# EAGLE design 5v_AC_DC (EAGLE 9.6.2)
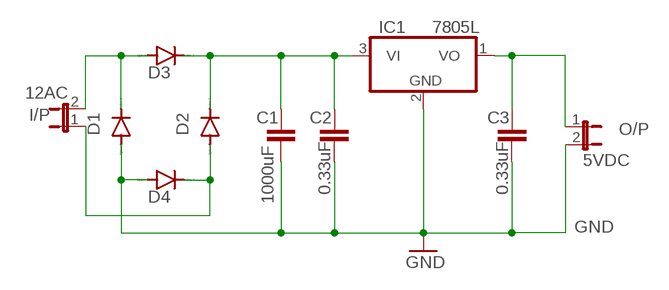
[diagram p0: schematic, sheet 1]

## Parts
C1  1000uF  C2,5-3  [C2.5-3]
C2  0.33uF  C2,5-3  [C2.5-3]
C3  0.33uF  C2,5-3  [C2.5-3]
D1  1N4004  [DO41-10]
D2  1N4004  [DO41-10]
D3  1N4004  [DO41-10]
D4  1N4004  [DO41-10]
I/P  12AC  JP1E  [JP1]
IC1  7805L  [TO92]
O/P  5VDC  JP1E  [JP1]

## Nets
GND: C1.2 C2.2 C3.2 D1.A D4.A IC1.2(GND) O/P.2
N$1: C3.1 IC1.1(VO) O/P.1
N$3: C1.1 C2.1 D2.C D3.C IC1.3(VI)
N$4: D2.A D4.C I/P.1
N$6: D1.C D3.A I/P.2

## Library data of the parts
C1-C3 = capacitor-wima:C: CAPACITOR naming: grid - package width
D1-D4 = diode:1N4004: DIODE general purpose rectifier, 1 A
I/P O/P = jumper:JP1E: JUMPER
IC1 = linear:78*: Positive VOLTAGE REGULATOR Source: http://cache.national.com/ds/LM/LM78L05.pdf http://www.fairchildsemi.com/ds/LM/LM7805.pdf

## Board
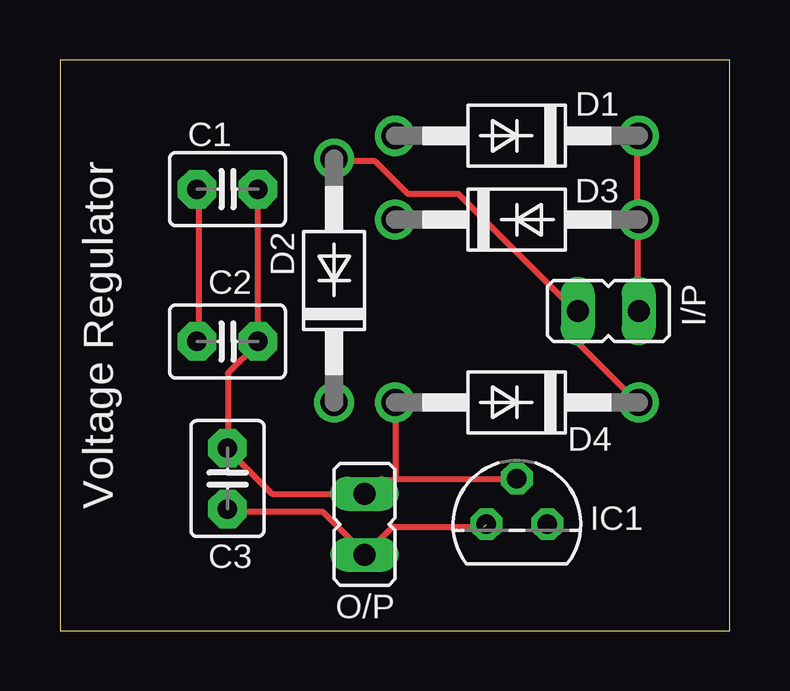
[diagram p1: board, top side]
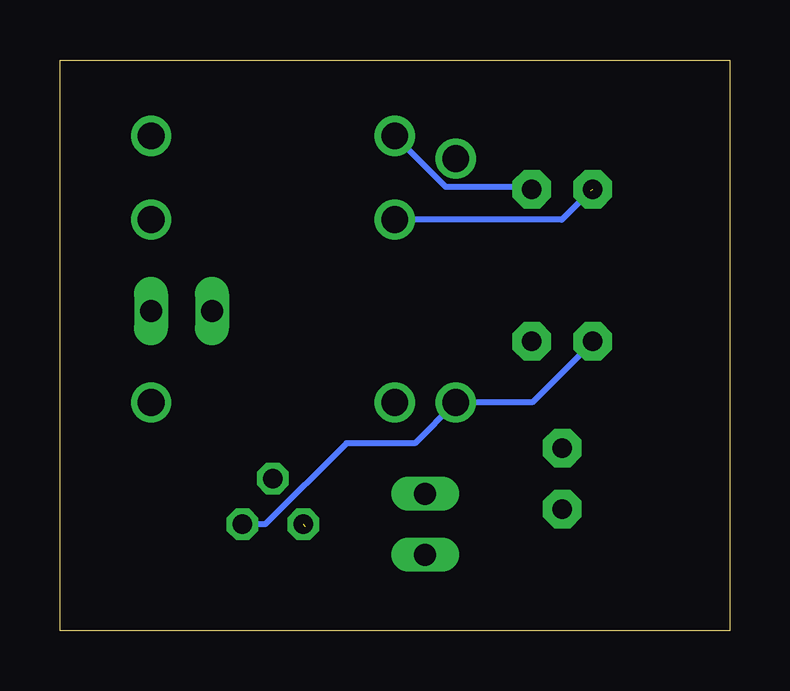
[diagram p2: board, bottom side, seen from below]

Size 27.93 x 23.8 mm. Coordinates in mm from the lower left corner, seen from the top.
Outline: 0,0 27.93,0 27.93,23.8 0,23.8 0,0
Copper layers (1*16): Top 0.035mm / dielectric 1.5mm / Bottom 0.035mm
Design rules "default": minimum track width 6mil, minimum drill 0.35mm, track to track 6mil, track to pad 6mil, pad to pad 6mil, via to via 6mil, smd to smd 6mil, copper to edge 40mil, drill to drill 6mil, minimum pad ring 10mil, minimum via ring 8mil, stop-mask expansion 4mil, vias tented up to drill 0mil, thermal gap 10mil

### Footprints (pad centres in the part's own frame; a part is rotated, then mirrored left to right if it is on the bottom)
C2.5-3 = drill 0.813 pad 1.6 octagon: 1 -1.27,0; 2 1.27,0
DO41-10 = drill 1.118: A 5.08,0; C -5.08,0
JP1 = drill 0.914 long: 1 0,-1.27; 2 0,1.27
TO92 = drill 0.813 octagon: 1 -1.27,0; 2 0,1.905; 3 1.27,0

### Placement (x,y rotation side)
C1  6.99,18.41 0 top
C2  6.99,12.06 0 top
C3  6.99,6.35 90 top
D1  19.05,20.64 180 top
D2  11.43,14.61 90 top
D3  19.05,17.14 0 top
D4  19.05,9.53 180 top
I/P  22.86,13.34 270 top
IC1  19.05,4.45 0 top
O/P  12.7,4.45 0 top

### Tracks (layer width: path | path; a pad name or v marks a point on that pad's centre or on a via)
GND
  Top 0.152: 13.41,6.33 14.02,6.33 | 19.05,6.33 IC1.2 | 12.8,5.71 O/P.2 | 14.02,9.53 D4.A | 7.01,7.7 C3.2 7.01,7.54 | 8.23,11.96 C2.2 8.23,12.12 | 8.23,18.36 C1.2
  Top 0.254: 19.05,6.33 14.02,6.33 14.02,9.53 | 12.8,5.71 13.41,6.33 | 7.01,7.7 7.01,10.74 8.23,11.96 | 8.23,18.36 8.23,12.12 | O/P.2 8.84,5.71 7.01,7.54
  Bottom 0.152: 8.38,18.52 C1.2
  Bottom 0.254: 8.38,18.52 11.85,18.52 D1.A
N$1  (1 unrouted)
  Top 0.152: 7.01,4.95 C3.1 | 12.65,3.28 O/P.1
  Top 0.254: 17.68,4.34 13.87,4.34 O/P.1 | 7.01,4.95 10.97,4.95 12.65,3.28
N$3  (1 unrouted)
  Top 0.152: 5.79,12.12 C2.1
  Top 0.254: 5.79,18.36 5.79,12.12
  Bottom 0.152: 5.79,18.36 C1.1 | 5.79,11.96 C2.1
  Bottom 0.254: IC1.3 19.37,4.45 15.99,7.82 13.13,7.82 D2.C 8.23,9.53 5.79,11.96 | D3.C 7.01,17.14 5.79,18.36
N$4
  Top 0.152: 21.64,13.34 I/P.1 21.49,13.34 | 24.08,9.53 D4.C | 11.43,19.58 D2.A
  Top 0.254: 21.64,13.34 21.64,11.96 24.08,9.53 | 11.43,19.58 13.13,19.58 14.5,18.21 16.61,18.21 21.49,13.34
N$6
  Top 0.152: 24.08,13.34 I/P.2 | 24.08,20.54 D1.C | 24.08,17.14 D3.A
  Top 0.254: 24.08,13.34 24.08,17.14 24.08,20.54

### Text on the board
tPlace: Voltage Regulator